# Altium project MB997.PrjPCB
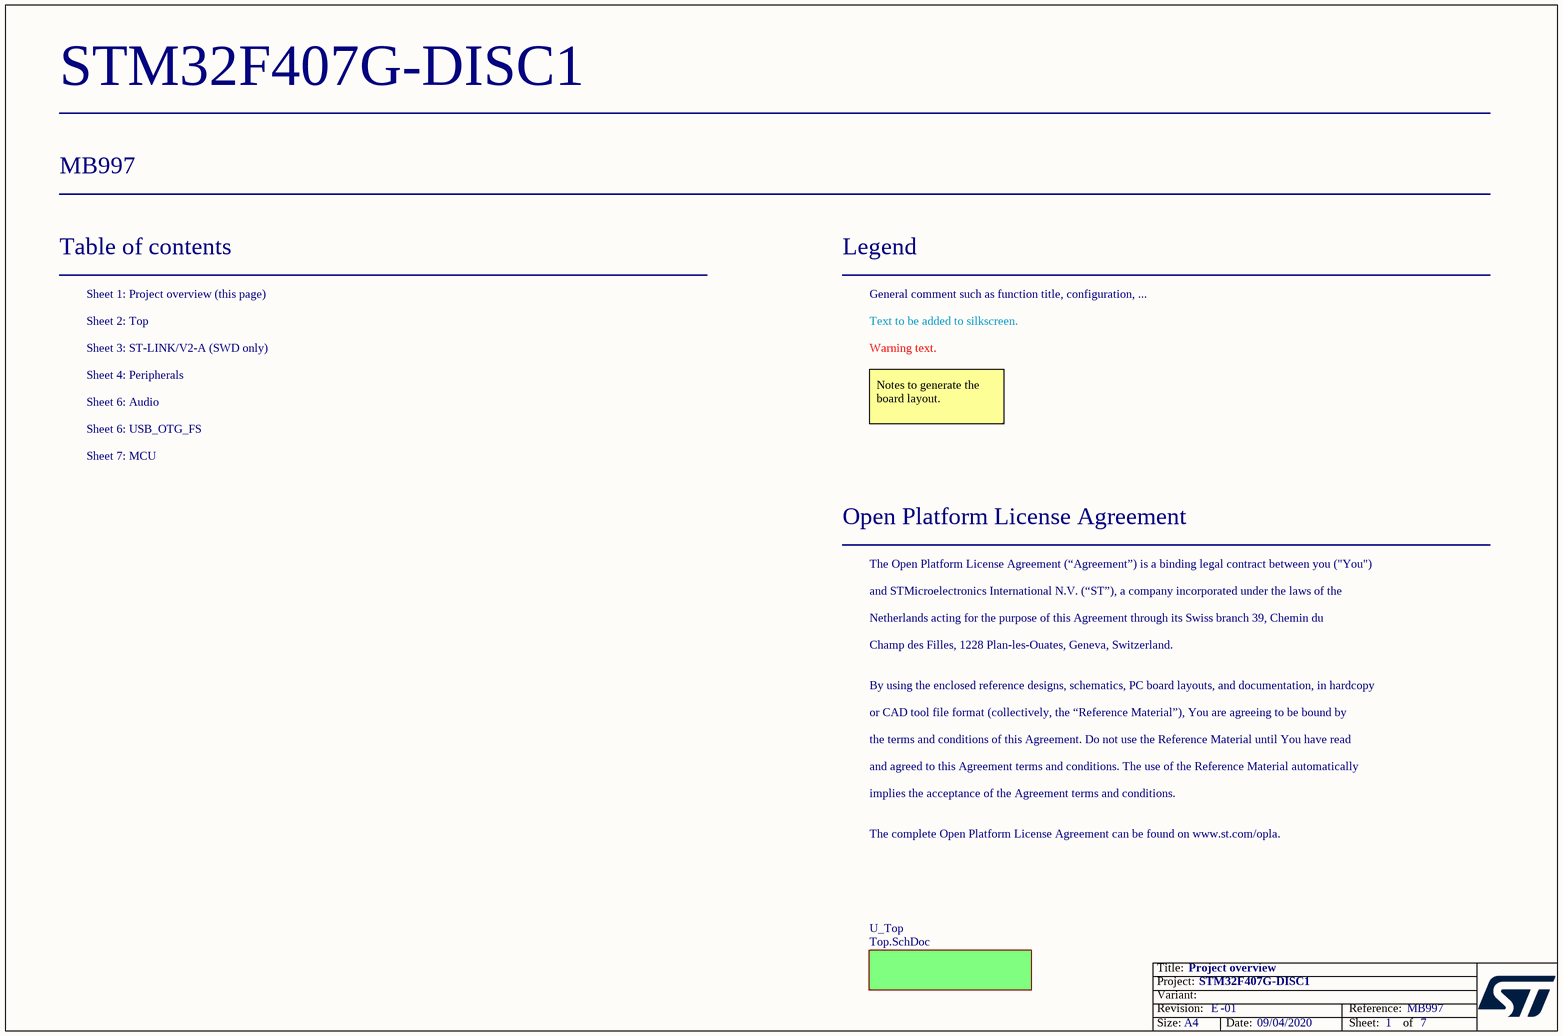
[diagram p0: Project_Overview.SchDoc]
Board_assembly_revision: 01; Board_Document_Date: 09/04/2020; Board_name: STM32F407G-DISC1; Board_PCB_REVISION: E; Board_reference: MB997
7 sheets, 191 parts. Net scope: flat (ports and power ports of the same name join across sheets).
Board file: MB997.PcbDoc
Sheets:
  Project_Overview.SchDoc
    U_Top = Top.SchDoc
      U_ST_LINK = ST_LINK_V2.SCHDOC
      U_Audio = Audio.SchDoc
      U_IO Peripherals = IO Peripherals.SchDoc
      U_STM32Fx = STM32Fx.SchDoc
      U_USB_OTG_FS = USB_OTG_FS.SchDoc

## Sheet Project_Overview.SchDoc: Project overview
size A4; Date: Not used; ApprovedBy: Not used; CheckedBy: Not used; Author: Not used; CompanyName: STMicroelectronics; DrawnBy: Not used; Engineer: Not used; Organization: Not used; Address1: Not used; Address2: Not used; Address3: Not used; Address4: Not used; DocumentNumber: 1; Revision: Not used; SheetNumber: 1; SheetTotal: 7; CurrentTime: Not used; CurrentDate: Not used; Time: Not used; DocumentFullPathAndName: Not used; DocumentName: Not used; ModifiedDate: Not used; ImagePath: Not used; ProjectName: Not used; Application_BuildNumber: Not used

### Sub-sheets
U_Top = Top.SchDoc: no entries

### Notes on the sheet
- Table of contents
- Sheet 1: Project overview (this page)
- Legend
- General comment such as function title, configuration, ...
- Sheet 2: Top
- Sheet 3: ST-LINK/V2-A (SWD only)
- Sheet 4: Peripherals
- Text to be added to silkscreen.
- Warning text.
- Sheet 6: Audio
- Sheet 6: USB_OTG_FS
- Notes to generate the board layout.
- Sheet 7: MCU
- Open Platform License Agreement
- The Open Platform License Agreement (“Agreement”) is a binding legal contract between you ("You")
- and STMicroelectronics International N.V. (“ST”), a company incorporated under the laws of the
- Netherlands acting for the purpose of this Agreement through its Swiss branch 39, Chemin du
- Champ des Filles, 1228 Plan-les-Ouates, Geneva, Switzerland.
- By using the enclosed reference designs, schematics, PC board layouts, and documentation, in hardcopy
- or CAD tool file format (collectively, the “Reference Material”), You are agreeing to be bound by
- the terms and conditions of this Agreement. Do not use the Reference Material until You have read
- and agreed to this Agreement terms and conditions. The use of the Reference Material automatically
- implies the acceptance of the Agreement terms and conditions.
- The complete Open Platform License Agreement can be found on www.st.com/opla.
- Title:
- Project:
- Size:
- Revision:
- Variant:
- A4
- -
- Date:
- Reference:
- Sheet:
- of

## Sheet Top.SchDoc: TOP
size A4; DocumentNumber: 2; Revision: D.1(PCB.SCH); SheetNumber: 2; SheetTotal: 7
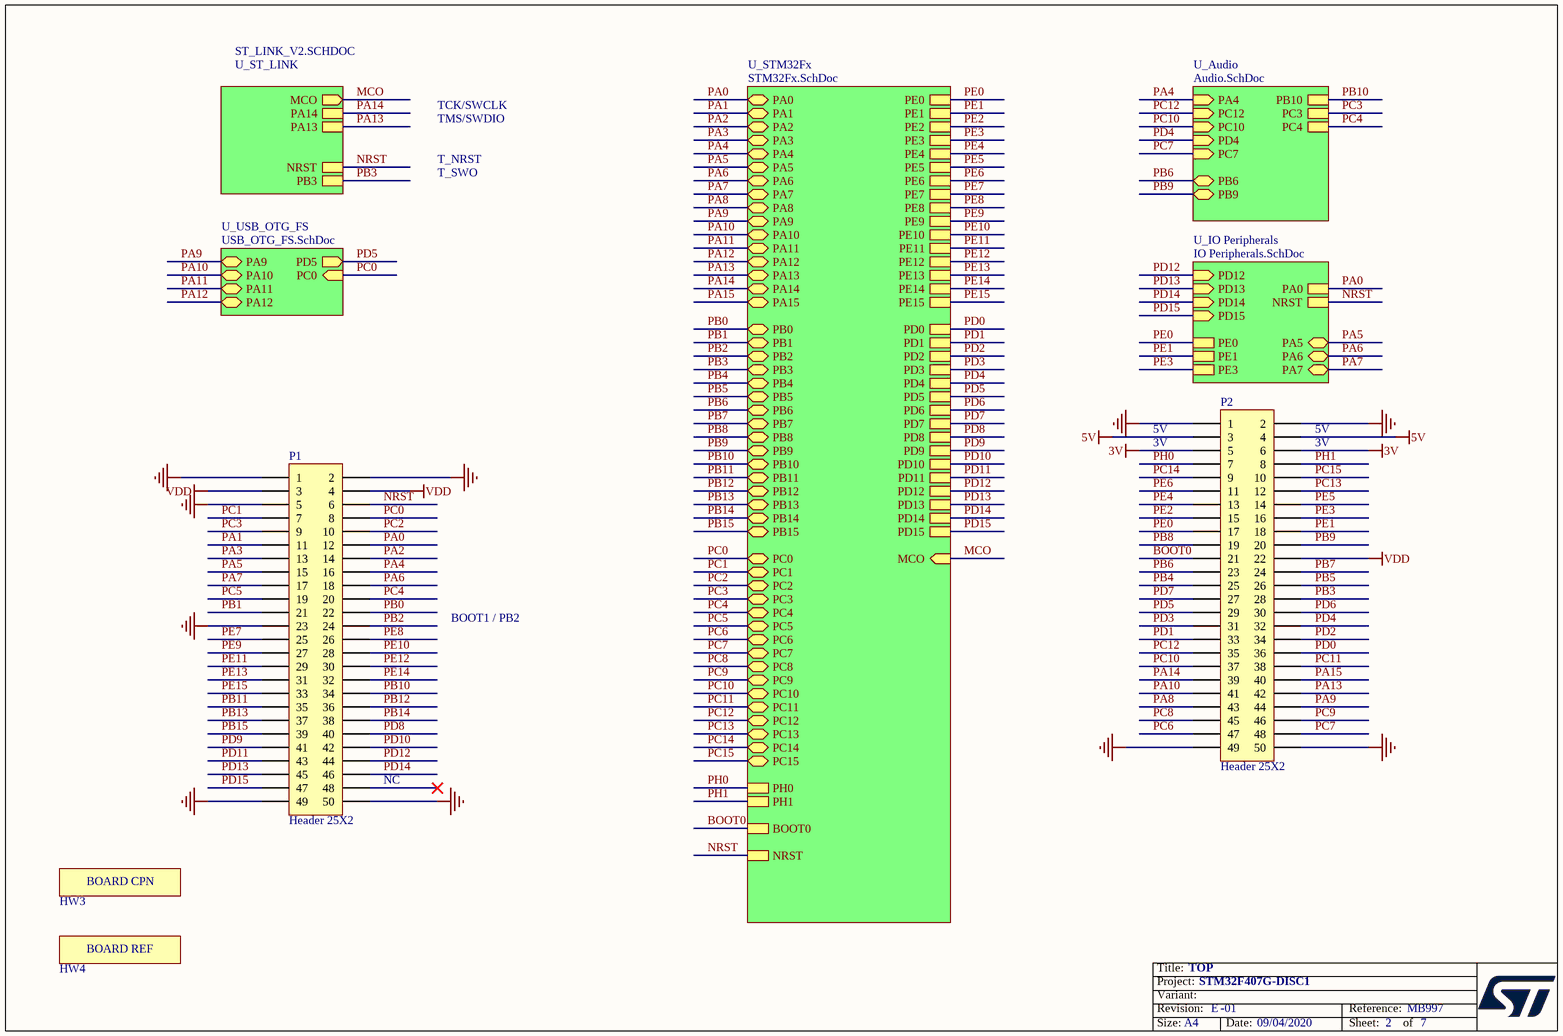
[diagram p1: Top.SchDoc]

### Parts
HW3  STICKER_BOARD_CPN  [STICKER_25X9_]  (value not drawn)  (no BOM)
HW4  STICKER_BOARD_REF  [STICKER_25X9_]  (value not drawn)  (no BOM)
P1  Header 25X2  [HEAD25X2$2F$2.54]
P2  Header 25X2  [HEAD25X2$2F$2.54]

### Sub-sheets
U_Audio = Audio.SchDoc: PA4 (in), PC12 (in), PC10 (in), PB6 (bidir), PB9 (bidir), PD4 (in), PC7 (in), PC3, PB10, PC4
U_IO Peripherals = IO Peripherals.SchDoc: PA0, NRST, PD12 (in), PE0, PD13 (in), PD14 (in), PD15 (in), PE1, PA5 (bidir), PA7 (bidir), PE3, PA6 (bidir)
U_ST_LINK = ST_LINK_V2.SCHDOC: PA13, PA14, NRST, PB3, MCO (out)
U_STM32Fx = STM32Fx.SchDoc: PA13 (bidir), PA14 (bidir), PA15 (bidir), PA12 (bidir), PA0 (bidir), PA1 (bidir), PA2 (bidir), PA3 (bidir), PA4 (bidir), PA5 (bidir), PA6 (bidir), PA7 (bidir), PA8 (bidir), PA9 (bidir), PA10 (bidir), PA11 (bidir), PB12 (bidir), PB0 (bidir), PB1 (bidir), PB2 (bidir), PB3 (bidir), PB4 (bidir), PB5 (bidir), PB6 (bidir), PB7 (bidir), PB8 (bidir), PB9 (bidir), PB10 (bidir), PB11 (bidir), PB13 (bidir), PB14 (bidir), PB15 (bidir), PC3 (bidir), PC15 (bidir), PC14 (bidir), PC13 (bidir), PC12 (bidir), PC11 (bidir), PC10 (bidir), PC9 (bidir), PC8 (bidir), PC7 (bidir), PC6 (bidir), PC5 (bidir), PC4 (bidir), PC2 (bidir), PC1 (bidir), PC0 (bidir), PD2, BOOT0, PH1, PH0, NRST, MCO (in), PE0, PE1, PE2, PE3, PE4, PE5, PE6, PE7, PE8, PE9, PE10, PE11, PE12, PE13, PE14, PE15, PD0, PD1, PD3, PD4, PD5, PD6, PD7, PD8, PD9, PD10, PD11, PD12, PD13, PD14, PD15
U_USB_OTG_FS = USB_OTG_FS.SchDoc: PD5 (out), PA11 (bidir), PA12 (bidir), PC0 (in), PA10 (bidir), PA9 (bidir)

### Nets
3V: P2.5 P2.6
5V: P2.3 P2.4
GND: P1.1 P1.2 P1.5 P1.23 P1.49 P1.50 P2.1 P2.2 P2.49 P2.50
VDD: P1.3 P1.4 P2.22
BOOT0: P2.21 ; sheet U_STM32Fx/BOOT0
MCO: sheet U_ST_LINK/MCO, sheet U_STM32Fx/MCO
NRST: P1.6 ; sheet U_ST_LINK/NRST, sheet U_IO Peripherals/NRST, sheet U_STM32Fx/NRST
PA0: P1.12 ; sheet U_IO Peripherals/PA0, sheet U_STM32Fx/PA0
PA1: P1.11 ; sheet U_STM32Fx/PA1
PA2: P1.14 ; sheet U_STM32Fx/PA2
PA3: P1.13 ; sheet U_STM32Fx/PA3
PA4: P1.16 ; sheet U_Audio/PA4, sheet U_STM32Fx/PA4
PA5: P1.15 ; sheet U_IO Peripherals/PA5, sheet U_STM32Fx/PA5
PA6: P1.18 ; sheet U_IO Peripherals/PA6, sheet U_STM32Fx/PA6
PA7: P1.17 ; sheet U_IO Peripherals/PA7, sheet U_STM32Fx/PA7
PA8: P2.43 ; sheet U_STM32Fx/PA8
PA9: P2.44 ; sheet U_STM32Fx/PA9, sheet U_USB_OTG_FS/PA9
PA10: P2.41 ; sheet U_STM32Fx/PA10, sheet U_USB_OTG_FS/PA10
PA11: sheet U_STM32Fx/PA11, sheet U_USB_OTG_FS/PA11
PA12: sheet U_STM32Fx/PA12, sheet U_USB_OTG_FS/PA12
PA13: P2.42 ; sheet U_ST_LINK/PA13, sheet U_STM32Fx/PA13
PA14: P2.39 ; sheet U_ST_LINK/PA14, sheet U_STM32Fx/PA14
PA15: P2.40 ; sheet U_STM32Fx/PA15
PB0: P1.22 ; sheet U_STM32Fx/PB0
PB1: P1.21 ; sheet U_STM32Fx/PB1
PB2: P1.24 ; sheet U_STM32Fx/PB2
PB3: P2.28 ; sheet U_ST_LINK/PB3, sheet U_STM32Fx/PB3
PB4: P2.25 ; sheet U_STM32Fx/PB4
PB5: P2.26 ; sheet U_STM32Fx/PB5
PB6: P2.23 ; sheet U_Audio/PB6, sheet U_STM32Fx/PB6
PB7: P2.24 ; sheet U_STM32Fx/PB7
PB8: P2.19 ; sheet U_STM32Fx/PB8
PB9: P2.20 ; sheet U_Audio/PB9, sheet U_STM32Fx/PB9
PB10: P1.34 ; sheet U_Audio/PB10, sheet U_STM32Fx/PB10
PB11: P1.35 ; sheet U_STM32Fx/PB11
PB12: P1.36 ; sheet U_STM32Fx/PB12
PB13: P1.37 ; sheet U_STM32Fx/PB13
PB14: P1.38 ; sheet U_STM32Fx/PB14
PB15: P1.39 ; sheet U_STM32Fx/PB15
PC0: P1.8 ; sheet U_STM32Fx/PC0, sheet U_USB_OTG_FS/PC0
PC1: P1.7 ; sheet U_STM32Fx/PC1
PC2: P1.10 ; sheet U_STM32Fx/PC2
PC3: P1.9 ; sheet U_Audio/PC3, sheet U_STM32Fx/PC3
PC4: P1.20 ; sheet U_Audio/PC4, sheet U_STM32Fx/PC4
PC5: P1.19 ; sheet U_STM32Fx/PC5
PC6: P2.47 ; sheet U_STM32Fx/PC6
PC7: P2.48 ; sheet U_Audio/PC7, sheet U_STM32Fx/PC7
PC8: P2.45 ; sheet U_STM32Fx/PC8
PC9: P2.46 ; sheet U_STM32Fx/PC9
PC10: P2.37 ; sheet U_Audio/PC10, sheet U_STM32Fx/PC10
PC11: P2.38 ; sheet U_STM32Fx/PC11
PC12: P2.35 ; sheet U_Audio/PC12, sheet U_STM32Fx/PC12
PC13: P2.12 ; sheet U_STM32Fx/PC13
PC14: P2.9 ; sheet U_STM32Fx/PC14
PC15: P2.10 ; sheet U_STM32Fx/PC15
PD0: P2.36 ; sheet U_STM32Fx/PD0
PD1: P2.33 ; sheet U_STM32Fx/PD1
PD2: P2.34 ; sheet U_STM32Fx/PD2
PD3: P2.31 ; sheet U_STM32Fx/PD3
PD4: P2.32 ; sheet U_Audio/PD4, sheet U_STM32Fx/PD4
PD5: P2.29 ; sheet U_STM32Fx/PD5, sheet U_USB_OTG_FS/PD5
PD6: P2.30 ; sheet U_STM32Fx/PD6
PD7: P2.27 ; sheet U_STM32Fx/PD7
PD8: P1.40 ; sheet U_STM32Fx/PD8
PD9: P1.41 ; sheet U_STM32Fx/PD9
PD10: P1.42 ; sheet U_STM32Fx/PD10
PD11: P1.43 ; sheet U_STM32Fx/PD11
PD12: P1.44 ; sheet U_IO Peripherals/PD12, sheet U_STM32Fx/PD12
PD13: P1.45 ; sheet U_IO Peripherals/PD13, sheet U_STM32Fx/PD13
PD14: P1.46 ; sheet U_IO Peripherals/PD14, sheet U_STM32Fx/PD14
PD15: P1.47 ; sheet U_IO Peripherals/PD15, sheet U_STM32Fx/PD15
PE0: P2.17 ; sheet U_IO Peripherals/PE0, sheet U_STM32Fx/PE0
PE1: P2.18 ; sheet U_IO Peripherals/PE1, sheet U_STM32Fx/PE1
PE2: P2.15 ; sheet U_STM32Fx/PE2
PE3: P2.16 ; sheet U_IO Peripherals/PE3, sheet U_STM32Fx/PE3
PE4: P2.13 ; sheet U_STM32Fx/PE4
PE5: P2.14 ; sheet U_STM32Fx/PE5
PE6: P2.11 ; sheet U_STM32Fx/PE6
PE7: P1.25 ; sheet U_STM32Fx/PE7
PE8: P1.26 ; sheet U_STM32Fx/PE8
PE9: P1.27 ; sheet U_STM32Fx/PE9
PE10: P1.28 ; sheet U_STM32Fx/PE10
PE11: P1.29 ; sheet U_STM32Fx/PE11
PE12: P1.30 ; sheet U_STM32Fx/PE12
PE13: P1.31 ; sheet U_STM32Fx/PE13
PE14: P1.32 ; sheet U_STM32Fx/PE14
PE15: P1.33 ; sheet U_STM32Fx/PE15
PH0: P2.7 ; sheet U_STM32Fx/PH0
PH1: P2.8 ; sheet U_STM32Fx/PH1

Not connected (* = marked no-connect by the designer): P1 48*

### Notes on the sheet
- TCK/SWCLK
- TMS/SWDIO
- T_SWO
- T_NRST
- 5V
- 3V
- (near P2) 5V
- (near P2) 3V
- BOOT1 / PB2
- (near P1) NC
- Title:
- Project:
- Size:
- Revision:
- Variant:
- A4
- -
- Date:
- Reference:
- Sheet:
- of
- (in symbol STICKER_BOARD_CPN) BOARD CPN
- (in symbol STICKER_BOARD_REF) BOARD REF

### Library data of the parts
P1 = Header 25X2: Header, 25-Pin, Dual row; Manuf_Part_1: 313250S141145; Manuf_1: LYCN; LatestRevisionDate: 17-Jul-2002; LatestRevisionNote: Re-released for DXP Platform.; Publisher: Altium Limited
P2 = Header 25X2: Header, 25-Pin, Dual row; Manuf_1: LYCN; Manuf_Part_1: 313250S141145; LatestRevisionDate: 17-Jul-2002; LatestRevisionNote: Re-released for DXP Platform.; Publisher: Altium Limited

## Sheet ST_LINK_V2.SCHDOC: ST-LINK/V2-A (SWD only)
size A4; DocumentNumber: 3; Revision: D.1(PCB.SCH); SheetNumber: 3; SheetTotal: 7
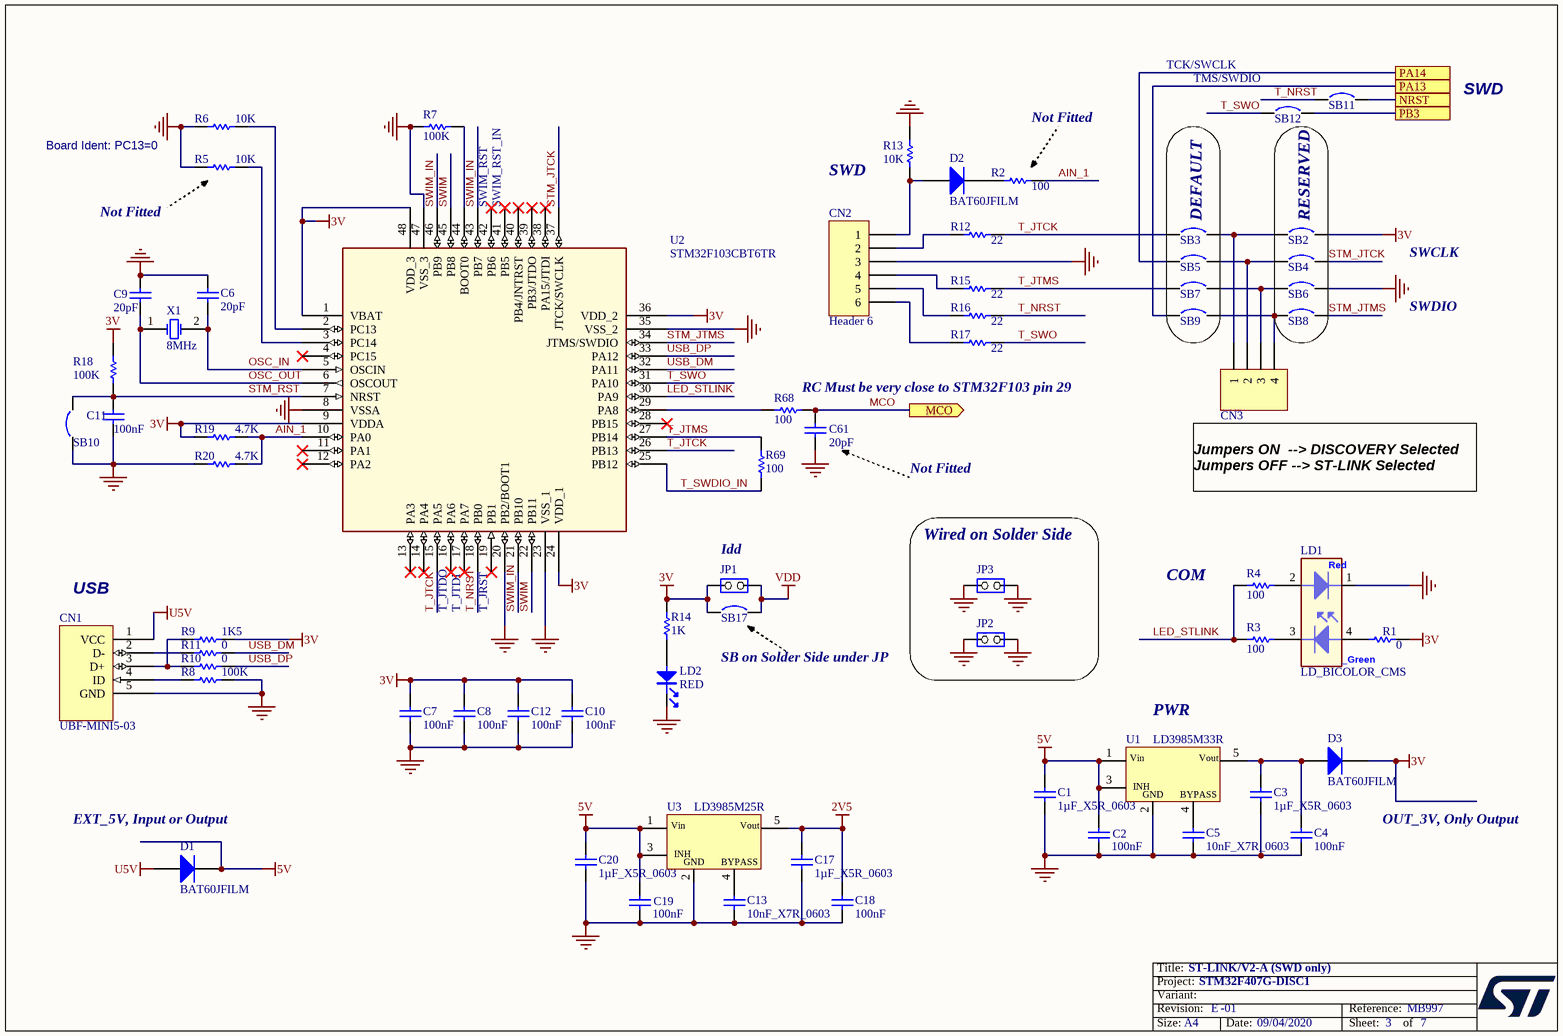
[diagram p2: ST_LINK_V2.SCHDOC]

### Parts
C1  1µF_X5R_0603  [0603C]
C2  100nF  [0402C]
C3  1µF_X5R_0603  [0603C]
C4  100nF  [0402C]
C5  10nF_X7R_0603  [0603C]
C6  20pF  [0402C]
C7  100nF  [0402C]
C8  100nF  [0402C]
C9  20pF  [0402C]
C10  100nF  [0402C]
C11  100nF  [0402C]
C12  100nF  [0402C]
C13  10nF_X7R_0603  [0603C]
C17  1µF_X5R_0603  [0603C]
C18  100nF  [0402C]
C19  100nF  [0402C]
C20  1µF_X5R_0603  [0603C]
C61  20pF  [0603C]
CN1  UBF-MINI5-03  [USB-MINI-B-SMD-A_]
CN2  Header 6  [HEADER6$2F$2.54]
CN3  Header 4  [HEADER4$2F$2.54]  (value not drawn)
D1  BAT60JFILM  [SOD323$2F$A]
D2  BAT60JFILM  [SOD323$2F$A]
D3  BAT60JFILM  [SOD323$2F$A]
JP1  (no value)  [SIP2$2F$2.54]
JP2  (no value)  [SIP2$2F$2.54]
JP3  (no value)  [SIP2$2F$2.54]
LD1  LD_BICOLOR_CMS  [AV02-0501EN]
LD2  RED  [LED0603]
R1  0  [0603R]
R2  100  [0402R]
R3  100  [0402R]
R4  100  [0402R]
R5  10K  [0402R]
R6  10K  [0402R]
R7  100K  [0402R]
R8  100K  [0402R]
R9  1K5  [0402R]
R10  0  [0603R]
R11  0  [0603R]
R12  22  [0402R]
R13  10K  [0402R]
R14  1K  [0402R]
R15  22  [0402R]
R16  22  [0402R]
R17  22  [0402R]
R18  100K  [0402R]
R19  4.7K  [0402R]
R20  4.7K  [0402R]
R68  100  [0603R]
R69  100  [0402R]
SB2  Circuit Breaker  [JUMPER]  (value not drawn)
SB3  Circuit Breaker  [JUMPER]  (value not drawn)
SB4  Circuit Breaker  [JUMPER]  (value not drawn)
SB5  Circuit Breaker  [JUMPER]  (value not drawn)
SB6  Circuit Breaker  [JUMPER]  (value not drawn)
SB7  Circuit Breaker  [JUMPER]  (value not drawn)
SB8  Circuit Breaker  [JUMPER]  (value not drawn)
SB9  Circuit Breaker  [JUMPER]  (value not drawn)
SB10  Circuit Breaker  [JUMPER]  (value not drawn)
SB11  Circuit Breaker  [JUMPER]  (value not drawn)
SB12  Circuit Breaker  [JUMPER]  (value not drawn)
SB17  Circuit Breaker  [JUMPER]  (value not drawn)
U1  LD3985M33R  [SOT-23-5L]
U2  STM32F103CBT6TR  [LQFP48$2F$0.5MM$5C$9X9B]
U3  LD3985M25R  [SOT-23-5L]
X1  8MHz  [HC-49A]

### Blocks framed on the sheet
DEFAULT: SB3 SB5 SB7 SB9
RESERVED: SB2 SB4 SB6 SB8
Wired on Solder Side: JP2 JP3

### Ports
MCO (out), NRST, PA13, PA14, PB3

### Nets
2V5: C17.1 C18.2 U3.5(Vout)
3V: C7.2 C8.2 C10.2 C12.1 D3.2(K) JP1.1(COMMON) R1.2 R9.2 R14.2 R18.2 R19.1 SB2.2 SB17.1 U2.1(VBAT) U2.9(VDDA) U2.24(VDD_1) U2.36(VDD_2) U2.48(VDD_3)
5V: C1.2 C2.2 C19.2 C20.2 D1.2(K) U1.1(Vin) U1.3(CE) U3.1(Vin) U3.3(CE)
GND: C1.1 C2.1 C3.2 C4.1 C5.1 C6.1 C7.1 C8.1 C9.1 C10.1 C11.1 C12.2 C13.1 C17.2 C18.1 C19.1 C20.1 C61.2 CN1.5(GND) CN2.3 JP2.1(COMMON) JP2.2(NO) JP3.1(COMMON) JP3.2(NO) LD1.1 LD2.2 R5.1 R6.1 R7.1 R8.2 R13.2 R20.1 SB6.2 SB10.1 U1.2(GND) U2.8(VSSA) U2.20(PB2/BOOT1) U2.23(VSS_1) U2.35(VSS_2) U2.47(VSS_3) U3.2(GND)
U5V: CN1.1(VCC) D1.1(A)
VDD: JP1.2(NO) SB17.2
AIN_1: R2.2 R19.2 R20.2 U2.10(PA0)
LED_STLINK: R3.1 R4.1 U2.30(PA9)
MCO: C61.1 R68.2 ; port MCO
NRST: SB11.2 ; port NRST
OSC_IN: C6.2 U2.5(OSCIN) X1.2(OSC2)
OSC_OUT: C9.2 U2.6(OSCOUT) X1.1(OSC1)
PA13: SB9.1 ; port PA13
PA14: SB5.1 ; port PA14
PB3: SB12.2 ; port PB3
STM_JTCK: SB4.2 U2.37(JTCK/SWCLK)
STM_JTMS: SB8.2 U2.34(JTMS/SWDIO)
STM_RST: C11.2 R18.1 SB10.2 U2.7(NRST)
SWIM: U2.22(PB11) U2.45(PB8)
SWIM_IN: U2.21(PB10) U2.43(PB7) U2.46(PB9)
T_JTCK: R12.2 SB3.1 U2.15(PA5) U2.26(PB13)
T_JTMS: R15.2 R69.2 SB7.1 U2.27(PB14)
T_NRST: R16.2 SB11.1 U2.18(PB0)
T_SWDIO_IN: R69.1 U2.25(PB12)
T_SWO: R17.2 SB12.1 U2.31(PA10)
USB_DM: R11.2 U2.32(PA11)
USB_DP: R10.2 U2.33(PA12)
NetC3_1: C3.1 C4.2 D3.1(A) U1.5(Vout)
NetC5_2: C5.2 U1.4(BYPASS)
NetC13_2: C13.2 U3.4(BYPASS)
NetCN1_2: CN1.2(D-) R11.1
NetCN1_3: CN1.3(D+) R9.1 R10.1
NetCN1_4: CN1.4(ID) R8.1
NetCN2_1: CN2.1 D2.1(A) R13.1
NetCN2_2: CN2.2 R12.1
NetCN2_4: CN2.4 R15.1
NetCN2_5: CN2.5 R16.1
NetCN2_6: CN2.6 R17.1
NetCN3_1: CN3.1 SB2.1 SB3.2
NetCN3_2: CN3.2 SB4.1 SB5.2
NetCN3_3: CN3.3 SB6.1 SB7.2
NetCN3_4: CN3.4 SB8.1 SB9.2
NetD2_2: D2.2(K) R2.1
NetLD1_2: LD1.2 R4.2
NetLD1_3: LD1.3 R3.2
NetLD1_4: LD1.4 R1.1
NetLD2_1: LD2.1 R14.1
NetR5_2: R5.2 U2.3(PC14)
NetR6_2: R6.2 U2.2(PC13)
NetR7_2: R7.2 U2.44(BOOT0)
NetR68_1: R68.1 U2.29(PA8)

Not connected (* = marked no-connect by the designer): U2 4(PC15)* 11(PA1)* 12(PA2)* 13(PA3)* 14(PA4)* 16(PA6)* 17(PA7)* 19(PB1)* 28(PB15)* 38(PA15/JTDI)* 39(PB3/JTDO)* 40(PB4/JNTRST)* 41(PB5)* 42(PB6)*

### Notes on the sheet
- TCK/SWCLK
- (near SB12) TMS/SWDIO
- SWD
- Board Ident: PC13=0
- Not Fitted
- SWIM_RST
- SWIM_RST_IN
- SWCLK
- SWDIO
- (near R68) RC Must be very close to STM32F103 pin 29
- Jumpers ON  --> DISCOVERY Selected
  Jumpers OFF --> ST-LINK Selected
- (near JP1) Idd
- COM
- (near CN1) USB
- (near U2) T_JTDO
- (near U2) T_JTDI
- (near U2) T_JRST
- SB on Solder Side under JP
- (near U1) PWR
- (near D1) EXT_5V, Input or Output
- OUT_3V, Only Output
- Title:
- Project:
- Size:
- Revision:
- Variant:
- A4
- -
- Date:
- Reference:
- Sheet:
- of
- (in symbol LD3985M25R) INH
- (in symbol LD3985M33R) INH
- (in symbol LD_BICOLOR_CMS) Red; _Green

### Library data of the parts
C1 C3 C17 C20 = CAP SMD 0603  X5R 1µF 25V 10%: 0603  X5R 1µF; Manuf_1: YAGEO; Manuf_Part_1: CC0603KRX5R7BB105; Value: 1uF; Rated voltage: 25V; Tolerance: 10%; Order code Farnell: 1288202RL; Power: *; Technology: X5R; Temperature  Factor: *; Temperature Max: +125°C; Temperature Min: -55°C; STS Code: *
C2 C4 C7 C8 C10-C12 C18 C19 = Cap: Capacitor; Manuf_Part_1: CC0402KRX7R7BB104; Manuf_1: YAGEO; Published: 8-Jun-2000; Revision: July-2002: Re-released for DXP Platform.; Publisher: Altium Limited; Value: 100nF
C5 C13 = CAP SMD 0603  X7R 10000PF 50V 10%: 0603  X7R 10NF; Manuf_1: YAGEO; Manuf_Part_1: CC0603KRX7R9BB103; Order code RS: 2040779; Rated voltage: 50V; Tolerance: 10%; Order code Farnell: 7569548RL; Value: 10nF; Power: *; Technology: X7R; Temperature Factor: *; Temperature Min: -55°C; Temperature Max: +125°C; STS Code: *
C6 C9 = Cap: Capacitor; Manuf_Part_1: CC0402JRNPO9BN200; Manuf_1: YAGEO; Published: 8-Jun-2000; Publisher: Altium Limited; Value: 20pF; Revision: July-2002: Re-released for DXP Platform.
C61 = Cap: Capacitor; Fitted: NO; Published: 8-Jun-2000; Publisher: Altium Limited; Value: 20pF; Revision: July-2002: Re-released for DXP Platform.
CN1 = USB-MINI-typeB connector_: Manuf_1: MTCONN; Manuf_Part_1: UBF-MINI5-03
CN2 = Header 6: Header, 6-Pin; Manuf_Part_1: 313106S141116; Manuf_1: LYCN; LatestRevisionDate: 17-Jul-2002; LatestRevisionNote: Re-released for DXP Platform.; Publisher: Altium Limited
CN3 = Header 4: Header, 4-Pin; Manuf_1: LYCN; Manuf_Part_1: 313104S141116; Revision: 17-Jul-2002: Re-released for DXP Platform.; Publisher: Altium Limited
D1-D3 = BAT60JFILM: Manuf_1: STM; Code - JEDEC: DO-214-AB; Provided: ST; Published: 8-Jun-2000; Revision: July-2002: Re-released for DXP Platform.; Publisher: Altium Limited; Order: BAT60JFILM; Manuf_Part_1: BAT60JFILM
JP1 = JP2: Manuf_Part_1: 313102S141116; Manuf_1: LYCN
JP2 JP3 = JP2: Manuf_1: LYCN; Manuf_Part_1: 313102S141145
LD1 = LD_BICOLOR_CMS: Bicolor Led; Manuf_Part_1: HSMF-A201-A00J1; Manuf_1: Avago Technologies; Ref St: xxxxxx; cap_dec: ----; Distrib: RADIOSPARES; Footprint: HSMF-A201; support: ----
LD2 = PHOTO: Manuf_Part_1: 19-213-R6C-AP1Q2B-3T; Manuf_1: EVERLIGHT
R1 R10 R11 = res1: Resistor; Manuf_Part_1: RC0603JR-070RL; Manuf_1: YAGEO; Published: 8-Jun-2000; Revision: July-2002: Re-released for DXP Platform.; Publisher: Altium Limited; Value: 0
R2 = res1: Resistor; Fitted: NO; Published: 8-Jun-2000; Revision: July-2002: Re-released for DXP Platform.; Publisher: Altium Limited; Value: 100
R3 R4 R69 = res1: Resistor; Manuf_Part_1: RC0402FR-07100RL; Manuf_1: YAGEO; Published: 8-Jun-2000; Revision: July-2002: Re-released for DXP Platform.; Publisher: Altium Limited; Value: 100
R5 = res1: Resistor; Manuf_Part_1: RC0402FR-0710KL; Manuf_1: YAGEO; Fitted: NO; Published: 8-Jun-2000; Revision: July-2002: Re-released for DXP Platform.; Publisher: Altium Limited; Value: 10K
R6 R13 = res1: Resistor; Manuf_Part_1: RC0402FR-0710KL; Manuf_1: YAGEO; Published: 8-Jun-2000; Revision: July-2002: Re-released for DXP Platform.; Publisher: Altium Limited; Value: 10K
R7 R8 R18 = res1: Resistor; Manuf_Part_1: RC0402FR-07100KL; Manuf_1: YAGEO; Published: 8-Jun-2000; Revision: July-2002: Re-released for DXP Platform.; Publisher: Altium Limited; Value: 100K
R9 = res1: Resistor; Manuf_Part_1: RC0402FR-071K5L; Manuf_1: YAGEO; Published: 8-Jun-2000; Revision: July-2002: Re-released for DXP Platform.; Publisher: Altium Limited; Value: 1K5
R12 R15-R17 = res1: Resistor; Manuf_Part_1: RC0402FR-0722RL; Manuf_1: YAGEO; Published: 8-Jun-2000; Revision: July-2002: Re-released for DXP Platform.; Publisher: Altium Limited; Value: 22
R14 = res1: Resistor; Manuf_Part_1: RC0402FR-071KL; Manuf_1: YAGEO; Published: 8-Jun-2000; Revision: July-2002: Re-released for DXP Platform.; Publisher: Altium Limited; Value: 1K
R19 R20 = res1: Resistor; Manuf_Part_1: RC0402FR-074K7L; Manuf_1: YAGEO; Published: 8-Jun-2000; Revision: July-2002: Re-released for DXP Platform.; Publisher: Altium Limited; Value: 4.7K
R68 = res1: Resistor; Manuf_Part_1: RC0603FR-07100RL; Manuf_1: YAGEO; Published: 8-Jun-2000; Revision: July-2002: Re-released for DXP Platform.; Publisher: Altium Limited; Value: 100
SB2 SB4 SB6 SB8 SB10 SB17 = Circuit Breaker: Solder: NO; Published: 24-Mar-1999; Revision: July-2002: Re-released for DXP Platform.; Publisher: Altium Limited
SB3 SB5 SB7 SB9 SB11 SB12 = Circuit Breaker: Solder: YES; Published: 24-Mar-1999; Revision: July-2002: Re-released for DXP Platform.; Publisher: Altium Limited
U1 = LD3985M33R: Ultra low drop-low noise BiCMOS voltage, regulators low ESR capacitors compatible; Manuf_1: STM; Provided: ST; Manuf_Part_1: LD3985M33R
U2 = STM32F103CBT6: Medium-density performance line ARM-based 32-bit MCU with 128KB Flash; Manuf_1: STM; Ref St: xxxxxxxx; Provided: ST; ECCN_US/EU: 3A991A2/NEC; Footprint: QFP48 7X7; Manuf_Part_1: STM32F103CBT6TR; Order: STM32F103CBT6; Distrib: ST
U3 = LD3985M25R: Ultra low drop-low noise BiCMOS voltage, regulators low ESR capacitors compatible; Manuf_1: STM; Provided: ST; Manuf_Part_1: LD3985M25R
X1 = XTAL: Crystal Oscillator; Manuf_Part_1: HC-49S-C20QSA-8.000MHZ; Manuf_1: jfvny; Published: 8-Jun-2000; LatestRevisionDate: 17-Jul-2002; LatestRevisionNote: Re-released for DXP Platform.; PackageReference: R38; Publisher: Altium Limited

## Sheet Audio.SchDoc: Audio
size A4; DocumentNumber: 5; Revision: D.1(PCB.SCH); SheetNumber: 5; SheetTotal: 7
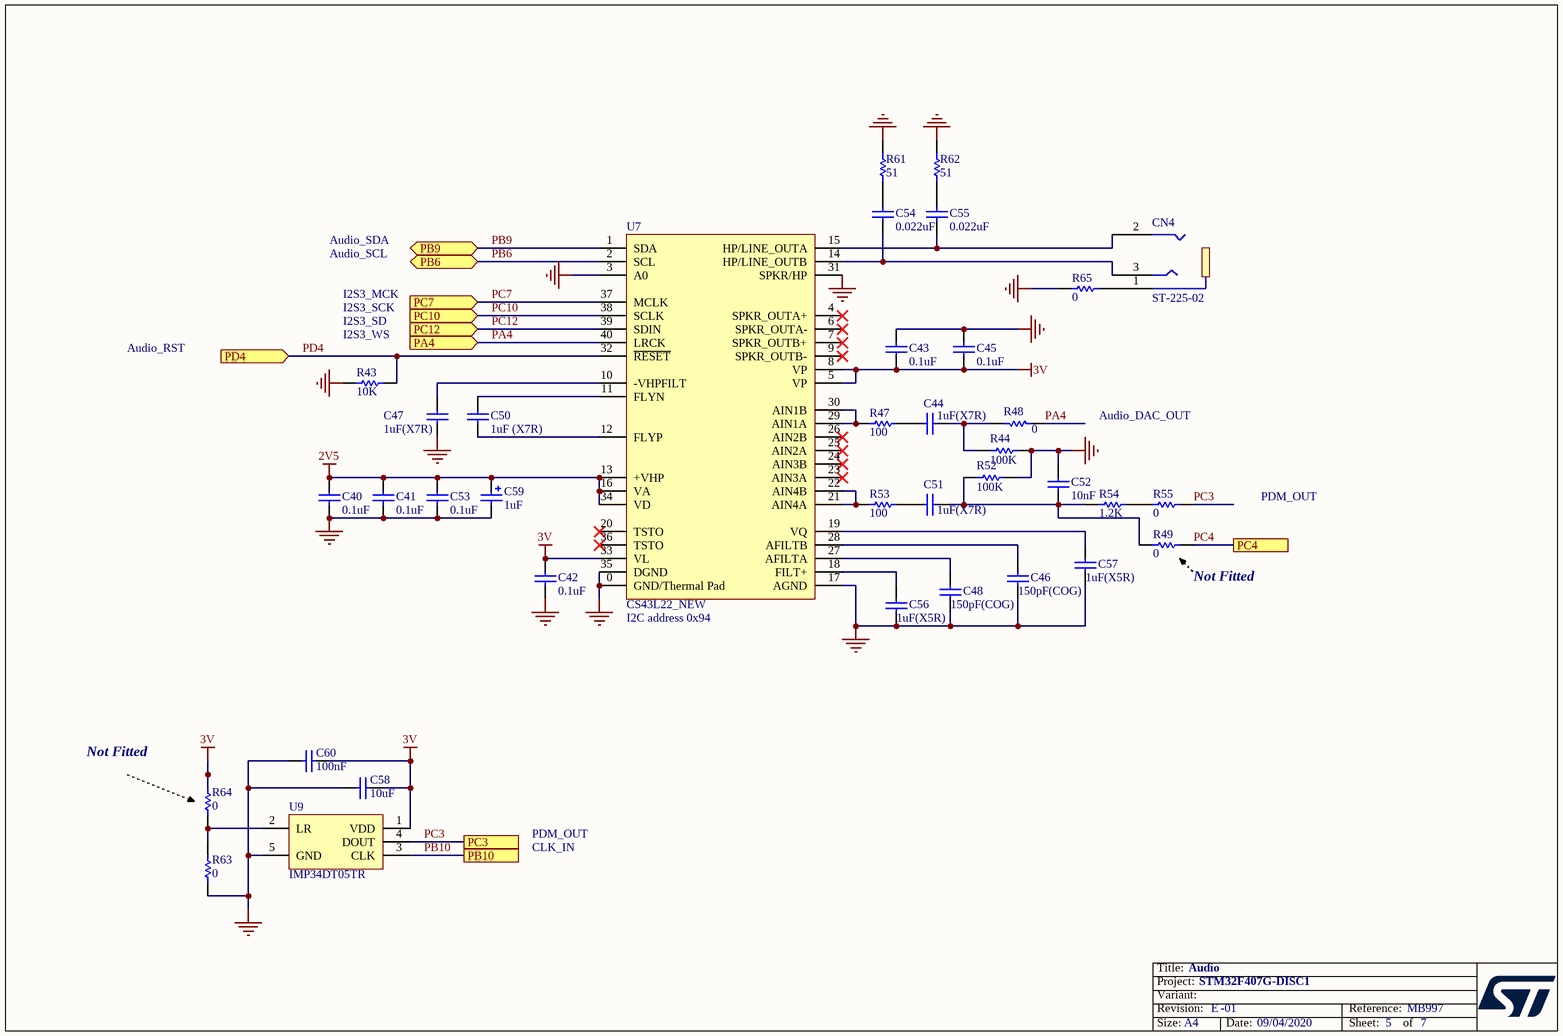
[diagram p3: Audio.SchDoc]

### Parts
C40  0.1uF  [0402C]
C41  0.1uF  [0402C]
C42  0.1uF  [0402C]
C43  0.1uF  [0402C]
C44  1uF(X7R)  [0603C]
C45  0.1uF  [0402C]
C46  150pF(COG)  [0603C]
C47  1uF(X7R)  [0603C]
C48  150pF(COG)  [0603C]
C50  1uF (X7R)  [0603C]
C51  1uF(X7R)  [0603C]
C52  10nF  [0603C]
C53  0.1uF  [0402C]
C54  0.022uF  [0603C]
C55  0.022uF  [0603C]
C56  1uF(X5R)  [0603C]
C57  1uF(X5R)  [0603C]
C58  10uF  [0603C]
C59  1uF  [CASE-A]
C60  100nF  [0402C]
CN4  ST-225-02  [PCBCOMPONENT_1$2F$2_new_]
R43  10K  [0402R]
R44  100K  [0402R]
R47  100  [0402R]
R48  0  [0603R]
R49  0  [0603R]
R52  100K  [0402R]
R53  100  [0402R]
R54  1.2K  [0603R]
R55  0  [0603R]
R61  51  [0603R]
R62  51  [0603R]
R63  0  [0402R]
R64  0  [0402R]
R65  0  [0603R]
U7  CS43L22_NEW  [QFN40(6_6)]
U9  IMP34DT05TR  [MIC_HCLGA_3X4X1_4LD_t]

### Ports
PA4 (in), PB6 (bidir), PB9 (bidir), PB10, PC3, PC4, PC7 (in), PC10 (in), PC12 (in), PD4 (in)

### Nets
2V5: C40.2 C41.2 C53.2 C59.1 U7.13(+VHP) U7.16(VA) U7.34(VD)
3V: C42.2 C43.2 C45.2 C58.2 C60.2 R64.2 U7.5(VP) U7.8(VP) U7.33(VL) U9.1(VDD)
GND: C40.1 C41.1 C42.1 C43.1 C45.1 C46.1 C47.2 C48.1 C52.2 C53.1 C56.1 C57.1 C58.1 C59.2 C60.1 R43.2 R44.2 R52.2 R61.1 R62.1 R63.1 R65.2 U7.0(GND/Thermal_Pad) U7.3(A0) U7.17(AGND) U7.31(SPKR/HP) U7.35(DGND) U9.5(GND)
PA4: R48.2 U7.40(LRCK) ; port PA4
PB6: U7.2(SCL) ; port PB6
PB9: U7.1(SDA) ; port PB9
PB10: U9.3(CLK) ; port PB10
PC3: R55.1 U9.4(DOUT) ; port PC3
PC4: R49.1 ; port PC4
PC7: U7.37(MCLK) ; port PC7
PC10: U7.38(SCLK) ; port PC10
PC12: U7.39(SDIN) ; port PC12
PD4: R43.1 U7.32(~{RESET}) ; port PD4
NetC44_1: C44.1 R47.1
NetC44_2: C44.2 R44.1 R48.1
NetC46_2: C46.2 U7.28(AFILTB)
NetC47_1: C47.1 U7.10(-VHPFILT)
NetC48_2: C48.2 U7.27(AFILTA)
NetC50_1: C50.1 U7.12(FLYP)
NetC50_2: C50.2 U7.11(FLYN)
NetC51_1: C51.1 R53.1
NetC51_2: C51.2 C52.1 R49.2 R52.1 R54.1
NetC54_1: C54.1 R61.2
NetC54_2: C54.2 CN4.3 U7.14(HP/LINE_OUTB)
NetC55_1: C55.1 R62.2
NetC55_2: C55.2 CN4.2 U7.15(HP/LINE_OUTA)
NetC56_2: C56.2 U7.18(FILT+)
NetC57_2: C57.2 U7.19(VQ)
NetCN4_1: CN4.1 R65.1
NetR47_2: R47.2 U7.29(AIN1A) U7.30(AIN1B)
NetR53_2: R53.2 U7.21(AIN4A) U7.22(AIN4B)
NetR54_2: R54.2 R55.2
NetR63_2: R63.2 R64.1 U9.2(LR)

Not connected (* = marked no-connect by the designer): U7 4(SPKR_OUTA+)* 6(SPKR_OUTA-)* 7(SPKR_OUTB+)* 9(SPKR_OUTB-)* 20(TSTO)* 23(AIN3A)* 24(AIN3B)* 25(AIN2A)* 26(AIN2B)* 36(TSTO)*

### Notes on the sheet
- Audio_SDA
- Audio_SCL
- I2S3_MCK
- I2S3_SCK
- Audio_RST
- (near R43) I2S3_WS
- I2S3_SD
- Audio_DAC_OUT
- PDM_OUT
- (near R49) Not Fitted
- (near U7) I2C address 0x94
- Not Fitted
- CLK_IN
- Title:
- Project:
- Size:
- Revision:
- Variant:
- A4
- -
- Date:
- Reference:
- Sheet:
- of

### Library data of the parts
C40-C43 C53 = CAP: Capacitor; Manuf_1: YAGEO; Manuf_Part_1: CC0402KRX7R7BB104; Value: 100nF; Published: 8-Jun-2000; Revision: July-2002: Re-released for DXP Platform.; Publisher: Altium Limited
C44 C47 C50 C51 C56 C57 = CAP: Capacitor; Manuf_Part_1: CC0603KRX5R7BB105; Manuf_1: YAGEO; Published: 8-Jun-2000; Revision: July-2002: Re-released for DXP Platform.; Publisher: Altium Limited; Value: 1uF
C45 = CAP: Capacitor; Manuf_Part_1: CC0402KRX7R7BB104; Manuf_1: YAGEO; Value: 100nF; Published: 8-Jun-2000; Revision: July-2002: Re-released for DXP Platform.; Publisher: Altium Limited
C46 C48 = CAP: Capacitor; Manuf_Part_1: CC0603JRNPO9BN151; Manuf_1: YAGEO; Published: 8-Jun-2000; Revision: July-2002: Re-released for DXP Platform.; Publisher: Altium Limited; Value: 150pF
C52 = CAP: Capacitor; Manuf_Part_1: CC0603KRX7R9BB103; Manuf_1: YAGEO; Published: 8-Jun-2000; Revision: July-2002: Re-released for DXP Platform.; Publisher: Altium Limited; Value: 10nF
C54 C55 = CAP: Capacitor; Manuf_Part_1: CC0603KRX7R9BB223; Manuf_1: YAGEO; Published: 8-Jun-2000; Revision: July-2002: Re-released for DXP Platform.; Publisher: Altium Limited; Value: 0.022uF
C58 = CAP: Capacitor; Manuf_Part_1: CC0603KRX5R5BB106; Manuf_1: YAGEO; Published: 8-Jun-2000; Revision: July-2002: Re-released for DXP Platform.; Publisher: Altium Limited; Value: 10uF
C59 = Cap Pol1: Polarized Capacitor (Radial); Manuf_Part_1: TAJA105K016R; Manuf_1: AVX; Published: 8-Jun-2000; Revision: July-2002: Re-released for DXP Platform.; Publisher: Altium Limited; Value: 1uF
C60 = CAP: Capacitor; Manuf_Part_1: CC0402KRX7R7BB104; Manuf_1: YAGEO; Published: 8-Jun-2000; Revision: July-2002: Re-released for DXP Platform.; Publisher: Altium Limited; Value: 100nF
CN4 = ST-225-02_: Connector Jack 35mm; Manuf_1: XIEJIA Electronics; Order: ST-225-02; Manuf_Part_1: ST-225-02
R43 = res1: as R6 on sheet ST_LINK_V2; Published: 8-Jun-2000; Revision: July-2002: Re-released for DXP Platform.; Publisher: Altium Limited; Value: 10K
R44 R52 = res1: as R7 on sheet ST_LINK_V2; Published: 8-Jun-2000; Revision: July-2002: Re-released for DXP Platform.; Publisher: Altium Limited; Value: 100K
R47 R53 = res1: as R3 on sheet ST_LINK_V2; Published: 8-Jun-2000; Revision: July-2002: Re-released for DXP Platform.; Publisher: Altium Limited; Value: 100
R48 R55 R65 = res1: as R1 on sheet ST_LINK_V2; Published: 8-Jun-2000; Revision: July-2002: Re-released for DXP Platform.; Publisher: Altium Limited; Value: 0
R49 = res1: Resistor; Manuf_Part_1: RC0603JR-070RL; Manuf_1: YAGEO; Fitted: NO; Published: 8-Jun-2000; Revision: July-2002: Re-released for DXP Platform.; Publisher: Altium Limited; Value: 0
R54 = res1: Resistor; Manuf_Part_1: RC0603FR-071K2L; Manuf_1: YAGEO; Published: 8-Jun-2000; Revision: July-2002: Re-released for DXP Platform.; Publisher: Altium Limited; Value: 1.2K
R61 R62 = res1: Resistor; Manuf_Part_1: RC0603FR-0751RL; Manuf_1: YAGEO; Published: 8-Jun-2000; Revision: July-2002: Re-released for DXP Platform.; Publisher: Altium Limited; Value: 51
R63 = res1: Resistor; Manuf_part_1: RC0402JR-070RL; Manuf_1: YAGEO; Published: 8-Jun-2000; Revision: July-2002: Re-released for DXP Platform.; Publisher: Altium Limited; Value: 0
R64 = res1: Resistor; Fitted: NO; Published: 8-Jun-2000; Revision: July-2002: Re-released for DXP Platform.; Publisher: Altium Limited; Value: 0
U7 = CS43L22_NEW: Low Power, Stereo DAC w/Headphone & Speaker Amps; Manuf_1: Cirrus; Manuf_Part_1: CS43L22-CNZ; Order: *; Fooprint: *
U9 = IMP34DT05TR: MEMS audio sensor omnidirectional digital microphone for industrial applications; Manuf_1: STM; Provided: ST; Ref St: 9177995; Manuf_Part_1: IMP34DT05TR; Order: *

## Sheet IO Peripherals.SchDoc: Peripherals
size A4; DocumentNumber: 4; Revision: D.1(PCB.SCH); SheetNumber: 4; SheetTotal: 7
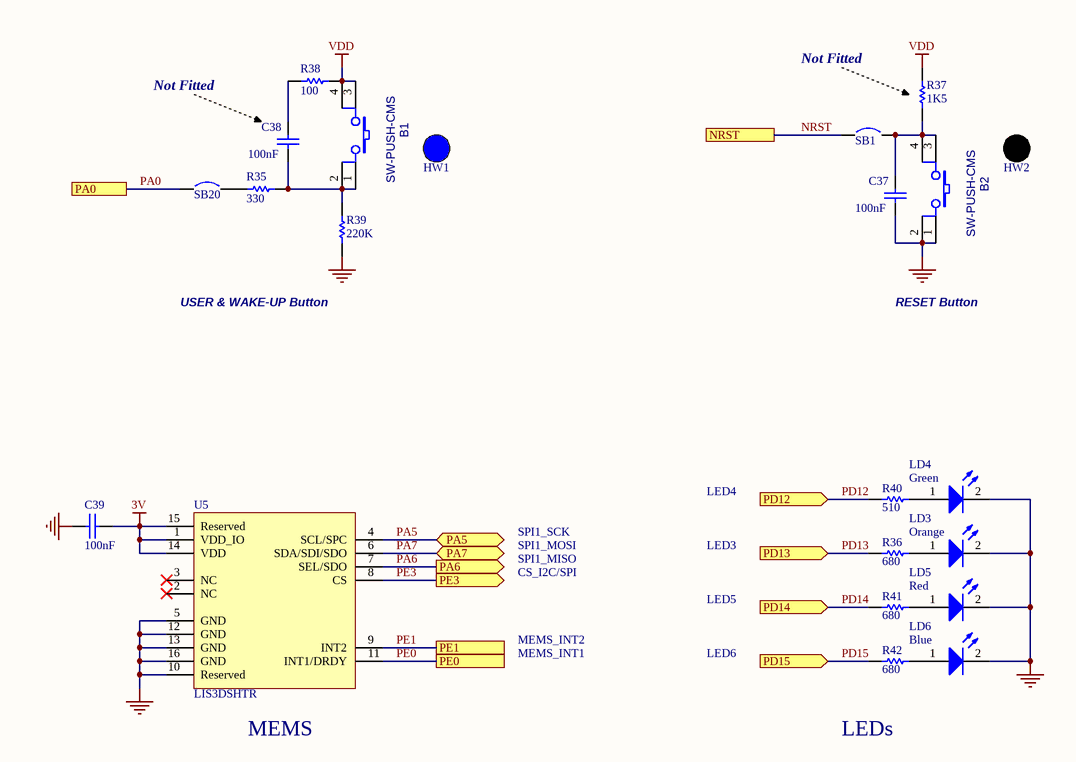
[diagram p4: IO Peripherals.SchDoc]

### Parts
B1  SW-PUSH-CMS  [SW4SMD]
B2  SW-PUSH-CMS  [SW4SMD]
C37  100nF  [0402C]
C38  100nF  [0402C]
C39  100nF  [0402C]
HW1  BUTTON_HAT_BLUE  (value not drawn)  (mechanical)
HW2  BUTTON_HAT_BLACK  (value not drawn)  (mechanical)
LD3  Orange  [LED0603]
LD4  Green  [LED0603]
LD5  Red  [LED0603]
LD6  Blue  [LED0603]
R35  330  [0603R]
R36  680  [0603R]
R37  1K5  [0402R]
R38  100  [0402R]
R39  220K  [0603R]
R40  510  [0603R]
R41  680  [0603R]
R42  680  [0603R]
SB1  Circuit Breaker  [JUMPER]  (value not drawn)
SB20  Circuit Breaker  [JUMPER]  (value not drawn)
U5  LIS3DSHTR  [LGA16_]

### Ports
NRST, PA0, PA5 (bidir), PA6 (out), PA7 (bidir), PD12 (in), PD13 (in), PD14 (in), PD15 (in), PE0, PE1, PE3 (out)

### Nets
3V: C39.2 U5.1(VDD_IO) U5.14(VDD) U5.15(Reserved)
GND: B2.1 B2.2 C37.1 C39.1 LD3.2(K) LD4.2(K) LD5.2(K) LD6.2(K) R39.1 U5.5(GND) U5.10(Reserved) U5.12(GND) U5.13(GND) U5.16(GND)
VDD: B1.3 B1.4 R37.2 R38.2
NRST: SB1.1 ; port NRST
PA0: SB20.1 ; port PA0
PA5: U5.4(SCL/SPC) ; port PA5
PA6: U5.7(SEL/SDO) ; port PA6
PA7: U5.6(SDA/SDI/SDO) ; port PA7
PD12: R40.2 ; port PD12
PD13: R36.2 ; port PD13
PD14: R41.2 ; port PD14
PD15: R42.2 ; port PD15
PE0: U5.11(INT1/DRDY) ; port PE0
PE1: U5.9(INT2) ; port PE1
PE3: U5.8(CS) ; port PE3
NetB1_1: B1.1 B1.2 C38.1 R35.2 R39.2
NetB2_3: B2.3 B2.4 C37.2 R37.1 SB1.2
NetC38_2: C38.2 R38.1
NetLD3_1: LD3.1(A) R36.1
NetLD4_1: LD4.1(A) R40.1
NetLD5_1: LD5.1(A) R41.1
NetLD6_1: LD6.1(A) R42.1
NetR35_1: R35.1 SB20.2

Not connected (* = marked no-connect by the designer): U5 2(NC)* 3(NC)*

### Notes on the sheet
- Not Fitted
- USER & WAKE-UP Button
- RESET Button
- LED4
- SPI1_MOSI
- SPI1_SCK
- SPI1_MISO
- CS_I2C/SPI
- LED3
- MEMS_INT2
- LED5
- MEMS_INT1
- LED6
- (near U5) MEMS
- LEDs
- Title:
- Project:
- Size:
- Revision:
- Variant:
- A4
- -
- Date:
- Reference:
- Sheet:
- of

### Library data of the parts
B1 = SW-PUSH-CMS_NEW: Non-Open Push-Button 0.1A 24V; Manuf_1: CHAU-HUA; Manuf_Part_1: CTSM-644B-V-T/R; cap_dec: ---
B2 = SW-PUSH-CMS_NEW: Non-Open Push-Button 0.1A 24V; Manuf_1: CHAU-HUA; Manuf_Part_1: CTSM-644N-V-T/R; cap_dec: ---
C37 C39 = CAP: as C60 on sheet Audio; Value: 100nF
  C37: Published: 8-Jun-2000; Revision: July-2002: Re-released for DXP Platform.; Publisher: Altium Limited
C38 = CAP: Capacitor; Fitted: NO; Published: 8-Jun-2000; Revision: July-2002: Re-released for DXP Platform.; Publisher: Altium Limited; Value: 100nF
HW1 = BUTTON_HAT_BLUE: switch hat,blue; Manuf_Part_1: KTSC-62B; Manuf_1: CHAU-HUA
HW2 = BUTTON_HAT_BLACK: switch hat,black; Manuf_1: CHAU-HUA; Manuf_Part_1: KTSC-62K
LD3 = LED2: Typical RED, GREEN, YELLOW, AMBER GaAs LED; Manuf_Part_1: 19-217/S2C-AM2N2VY/3T; Manuf_1: EVERLIGHT; Published: 8-Jun-2000; Revision: July-2002: Re-released for DXP Platform.; Publisher: Altium Limited
LD4 = LED2: Typical RED, GREEN, YELLOW, AMBER GaAs LED; Manuf_1: EVERLIGHT; Manuf_Part_1: 19-213SYGC/S530-E2/TR8; Published: 8-Jun-2000; Revision: July-2002: Re-released for DXP Platform.; Publisher: Altium Limited
LD5 = LED2: Typical RED, GREEN, YELLOW, AMBER GaAs LED; Manuf_Part_1: 19-213-R6C-AP1Q2B-3T; Manuf_1: EVERLIGHT; Published: 8-Jun-2000; Revision: July-2002: Re-released for DXP Platform.; Publisher: Altium Limited
LD6 = LED2: Typical RED, GREEN, YELLOW, AMBER GaAs LED; Manuf_1: EVERLIGHT; Manuf_Part_1: 19-217/BHC-ZL1M2RY/3T; Published: 8-Jun-2000; Revision: July-2002: Re-released for DXP Platform.; Publisher: Altium Limited
R35 = res1: Resistor; Manuf_Part_1: RC0603FR-07330RL; Manuf_1: YAGEO; Published: 8-Jun-2000; Revision: July-2002: Re-released for DXP Platform.; Publisher: Altium Limited; Value: 330
R36 R41 R42 = Res1: Resistor; Manuf_Part_1: RC0603FR-07680RL; Manuf_1: YAGEO; Published: 8-Jun-2000; Revision: July-2002: Re-released for DXP Platform.; Publisher: Altium Limited; Value: 680
R37 = res1: Resistor; Manuf_Part_1: RC0402FR-071K5L; Manuf_1: YAGEO; Fitted: NO; Published: 8-Jun-2000; Revision: July-2002: Re-released for DXP Platform.; Publisher: Altium Limited; Value: 1K5
R38 = res1: as R3 on sheet ST_LINK_V2; Published: 8-Jun-2000; Revision: July-2002: Re-released for DXP Platform.; Publisher: Altium Limited; Value: 100
R39 = res1: Resistor; Manuf_Part_1: RC0603FR-07220KL; Manuf_1: YAGEO; Published: 8-Jun-2000; Revision: July-2002: Re-released for DXP Platform.; Publisher: Altium Limited; Value: 220K
R40 = Res1: Resistor; Manuf_Part_1: RC0603FR-07510RL; Manuf_1: YAGEO; Published: 8-Jun-2000; Revision: July-2002: Re-released for DXP Platform.; Publisher: Altium Limited; Value: 510
SB1 SB20 = Circuit Breaker: Solder: YES; Published: 24-Mar-1999; Revision: July-2002: Re-released for DXP Platform.; Publisher: Altium Limited
U5 = LIS3DSH_: MEMS motion sensor 3-axis - ±2g/±4g/±6g/±8g/±16g digital output accelerometer; Manuf_1: STM; Provided: ST; ref St: to be created; Manuf_Part_1: LIS3DSHTR; Distrib: STM; Footprint: LGA16(3*3); Order: LIS3DSHTR

## Sheet STM32Fx.SchDoc: MCU
size A4; DocumentNumber: 7; Revision: D.1(PCB.SCH); SheetNumber: 7; SheetTotal: 7
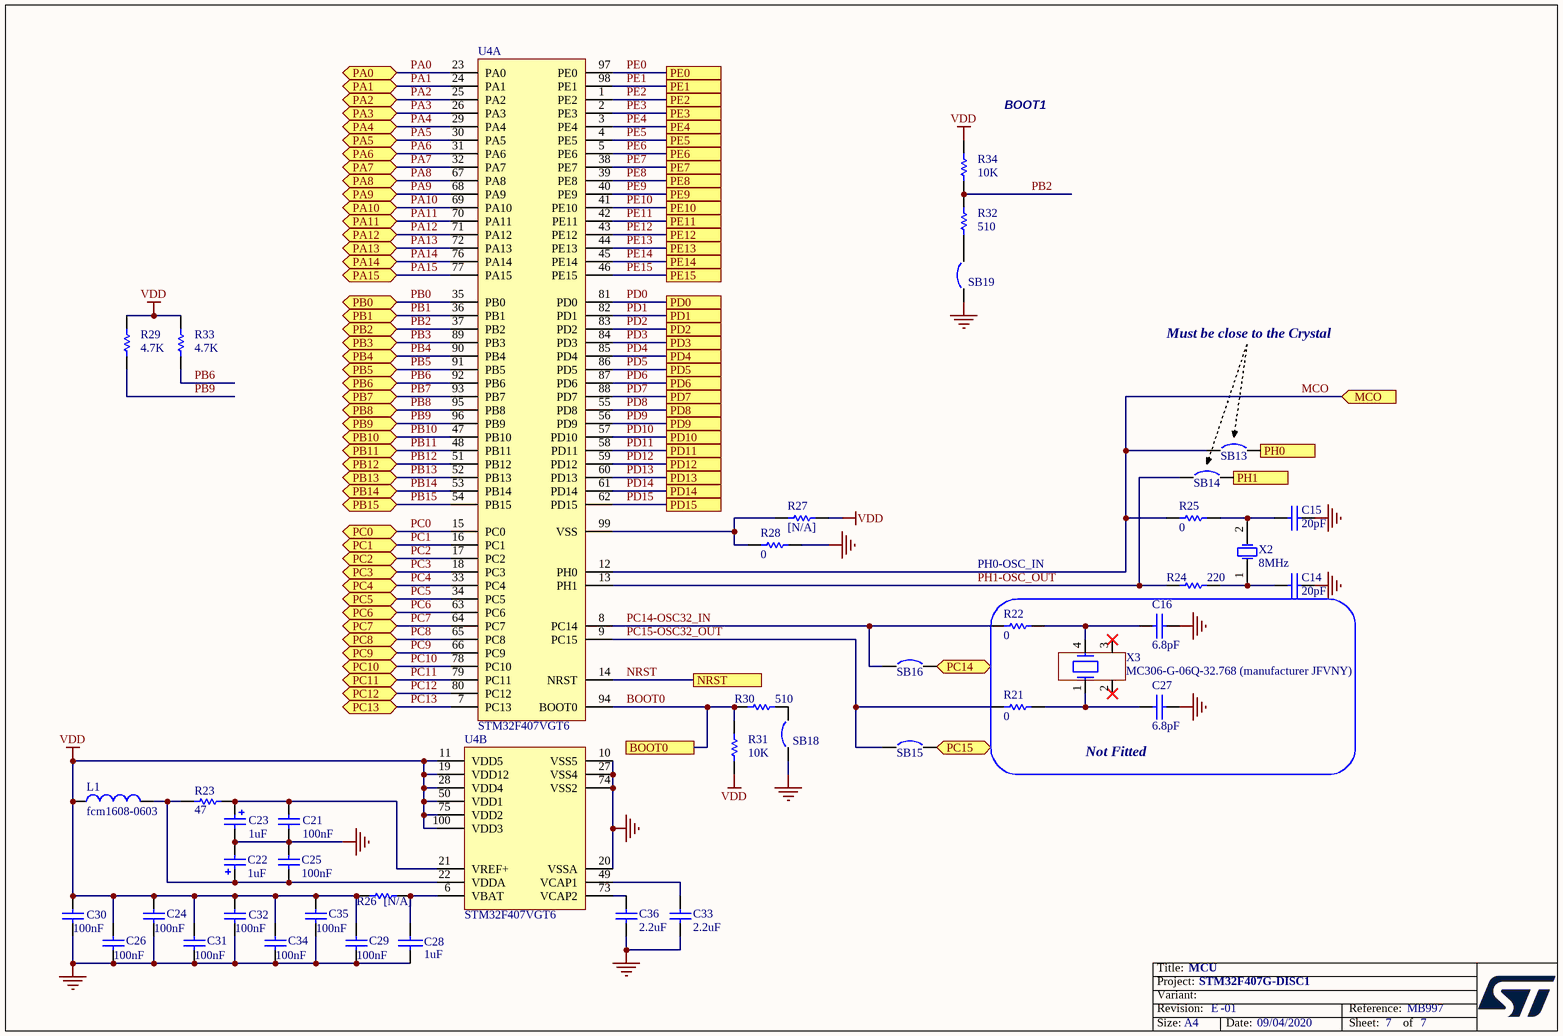
[diagram p5: STM32Fx.SchDoc]

### Parts
C14  20pF  [0603C]
C15  20pF  [0603C]
C16  6.8pF  [0603C]
C21  100nF  [0402C]
C22  1uF  [CASE-A]
C23  1uF  [CASE-A]
C24  100nF  [0402C]
C25  100nF  [0402C]
C26  100nF  [0402C]
C27  6.8pF  [0603C]
C28  1uF  [0603C]
C29  100nF  [0402C]
C30  100nF  [0402C]
C31  100nF  [0402C]
C32  100nF  [0402C]
C33  2.2uF  [CASE-A]
C34  100nF  [0402C]
C35  100nF  [0402C]
C36  2.2uF  [CASE-A]
L1  fcm1608-0603  [0603L]
R21  0  [0603R]
R22  0  [0603R]
R23  47  [0603R]
R24  220  [0603R]
R25  0  [0603R]
R26  [N/A]  [0603R]
R27  [N/A]  [0603R]
R28  0  [0603R]
R29  4.7K  [0402R]
R30  510  [0603R]
R31  10K  [0402R]
R32  510  [0603R]
R33  4.7K  [0402R]
R34  10K  [0402R]
SB13  Circuit Breaker  [JUMPER]  (value not drawn)
SB14  Circuit Breaker  [JUMPER]  (value not drawn)
SB15  Circuit Breaker  [JUMPER]  (value not drawn)
SB16  Circuit Breaker  [JUMPER]  (value not drawn)
SB18  Circuit Breaker  [JUMPER]  (value not drawn)
SB19  Circuit Breaker  [JUMPER]  (value not drawn)
U4  STM32F407VGT6  [QFP100-1414]  (parts A,B of 2)
X2  8MHz  [HC-49A]
X3  MC306-G-06Q-32.768 (manufacturer JFVNY)  [MC306-CRYSTAL]

### Blocks framed on the sheet
Not Fitted: C16 C27 R21 R22 X3

### Ports
BOOT0, MCO (in), NRST, PA0 (bidir), PA1 (bidir), PA2 (bidir), PA3 (bidir), PA4 (bidir), PA5 (bidir), PA6 (bidir), PA7 (bidir), PA8 (bidir), PA9 (bidir), PA10 (bidir), PA11 (bidir), PA12 (bidir), PA13 (bidir), PA14 (bidir), PA15 (bidir), PB0 (bidir), PB1 (bidir), PB2 (bidir), PB3 (bidir), PB4 (bidir), PB5 (bidir), PB6 (bidir), PB7 (bidir), PB8 (bidir), PB9 (bidir), PB10 (bidir), PB11 (bidir), PB12 (bidir), PB13 (bidir), PB14 (bidir), PB15 (bidir), PC0 (bidir), PC1 (bidir), PC2 (bidir), PC3 (bidir), PC4 (bidir), PC5 (bidir), PC6 (bidir), PC7 (bidir), PC8 (bidir), PC9 (bidir), PC10 (bidir), PC11 (bidir), PC12 (bidir), PC13 (bidir), PC14 (bidir), PC15 (bidir), PD0, PD1, PD2, PD3, PD4, PD5, PD6, PD7, PD8, PD9, PD10, PD11, PD12, PD13, PD14, PD15, PE0, PE1, PE2, PE3, PE4, PE5, PE6, PE7, PE8, PE9, PE10, PE11, PE12, PE13, PE14, PE15, PH0, PH1

### Nets
GND: C14.1 C15.1 C16.2 C21.1 C22.2 C23.2 C24.2 C25.1 C26.1 C27.2 C28.2 C29.1 C30.1 C31.1 C32.1 C33.2 C34.1 C35.2 C36.2 R28.2 SB18.1 SB19.1 U4.10(VSS5) U4.20(VSSA) U4.27(VSS4) U4.74(VSS2)
VDD: C24.1 C26.2 C29.2 C30.2 C31.2 C32.2 C34.2 C35.1 L1.1 R26.1 R27.2 R29.1 R31.2 R33.1 R34.1 U4.11(VDD5) U4.19(VDD12) U4.28(VDD4) U4.50(VDD1) U4.75(VDD2) U4.100(VDD3)
BOOT0: R30.2 R31.1 U4.94(BOOT0) ; port BOOT0
MCO: R25.1 SB13.1 U4.12(PH0) ; port MCO
NRST: U4.14(NRST) ; port NRST
PA0: U4.23(PA0) ; port PA0
PA1: U4.24(PA1) ; port PA1
PA2: U4.25(PA2) ; port PA2
PA3: U4.26(PA3) ; port PA3
PA4: U4.29(PA4) ; port PA4
PA5: U4.30(PA5) ; port PA5
PA6: U4.31(PA6) ; port PA6
PA7: U4.32(PA7) ; port PA7
PA8: U4.67(PA8) ; port PA8
PA9: U4.68(PA9) ; port PA9
PA10: U4.69(PA10) ; port PA10
PA11: U4.70(PA11) ; port PA11
PA12: U4.71(PA12) ; port PA12
PA13: U4.72(PA13) ; port PA13
PA14: U4.76(PA14) ; port PA14
PA15: U4.77(PA15) ; port PA15
PB0: U4.35(PB0) ; port PB0
PB1: U4.36(PB1) ; port PB1
PB2: R32.1 R34.2 U4.37(PB2) ; port PB2
PB3: U4.89(PB3) ; port PB3
PB4: U4.90(PB4) ; port PB4
PB5: U4.91(PB5) ; port PB5
PB6: R33.2 U4.92(PB6) ; port PB6
PB7: U4.93(PB7) ; port PB7
PB8: U4.95(PB8) ; port PB8
PB9: R29.2 U4.96(PB9) ; port PB9
PB10: U4.47(PB10) ; port PB10
PB11: U4.48(PB11) ; port PB11
PB12: U4.51(PB12) ; port PB12
PB13: U4.52(PB13) ; port PB13
PB14: U4.53(PB14) ; port PB14
PB15: U4.54(PB15) ; port PB15
PC0: U4.15(PC0) ; port PC0
PC1: U4.16(PC1) ; port PC1
PC2: U4.17(PC2) ; port PC2
PC3: U4.18(PC3) ; port PC3
PC4: U4.33(PC4) ; port PC4
PC5: U4.34(PC5) ; port PC5
PC6: U4.63(PC6) ; port PC6
PC7: U4.64(PC7) ; port PC7
PC8: U4.65(PC8) ; port PC8
PC9: U4.66(PC9) ; port PC9
PC10: U4.78(PC10) ; port PC10
PC11: U4.79(PC11) ; port PC11
PC12: U4.80(PC12) ; port PC12
PC13: U4.7(PC13) ; port PC13
PC14: SB16.2 ; port PC14
PC14-OSC32_IN: R22.1 SB16.1 U4.8(PC14)
PC15: SB15.2 ; port PC15
PC15-OSC32_OUT: R21.1 SB15.1 U4.9(PC15)
PD0: U4.81(PD0) ; port PD0
PD1: U4.82(PD1) ; port PD1
PD2: U4.83(PD2) ; port PD2
PD3: U4.84(PD3) ; port PD3
PD4: U4.85(PD4) ; port PD4
PD5: U4.86(PD5) ; port PD5
PD6: U4.87(PD6) ; port PD6
PD7: U4.88(PD7) ; port PD7
PD8: U4.55(PD8) ; port PD8
PD9: U4.56(PD9) ; port PD9
PD10: U4.57(PD10) ; port PD10
PD11: U4.58(PD11) ; port PD11
PD12: U4.59(PD12) ; port PD12
PD13: U4.60(PD13) ; port PD13
PD14: U4.61(PD14) ; port PD14
PD15: U4.62(PD15) ; port PD15
PE0: U4.97(PE0) ; port PE0
PE1: U4.98(PE1) ; port PE1
PE2: U4.1(PE2) ; port PE2
PE3: U4.2(PE3) ; port PE3
PE4: U4.3(PE4) ; port PE4
PE5: U4.4(PE5) ; port PE5
PE6: U4.5(PE6) ; port PE6
PE7: U4.38(PE7) ; port PE7
PE8: U4.39(PE8) ; port PE8
PE9: U4.40(PE9) ; port PE9
PE10: U4.41(PE10) ; port PE10
PE11: U4.42(PE11) ; port PE11
PE12: U4.43(PE12) ; port PE12
PE13: U4.44(PE13) ; port PE13
PE14: U4.45(PE14) ; port PE14
PE15: U4.46(PE15) ; port PE15
PH0: SB13.2 ; port PH0
PH1: SB14.2 ; port PH1
PH1-OSC_OUT: R24.2 SB14.1 U4.13(PH1)
NetC14_2: C14.2 R24.1 X2.1(OSC1)
NetC15_2: C15.2 R25.2 X2.2(OSC2)
NetC16_1: C16.1 R22.2 X3.4
NetC21_2: C21.2 C23.1 R23.1 U4.21(VREF+)
NetC22_1: C22.1 C25.2 L1.2 R23.2 U4.22(VDDA)
NetC27_1: C27.1 R21.2 X3.1
NetC28_1: C28.1 R26.2 U4.6(VBAT)
NetC33_1: C33.1 U4.49(VCAP1)
NetC36_1: C36.1 U4.73(VCAP2)
NetR27_1: R27.1 R28.1 U4.99(VSS)
NetR30_1: R30.1 SB18.2
NetR32_2: R32.2 SB19.2

Not connected (* = marked no-connect by the designer): X3 2* 3*

### Notes on the sheet
- BOOT1
- Must be close to the Crystal
- PH0-OSC_IN
- Title:
- Project:
- Size:
- Revision:
- Variant:
- A4
- -
- Date:
- Reference:
- Sheet:
- of

### Library data of the parts
C14 C15 = CAP: Capacitor; Manuf_Part_1: CC0603JRNPO9BN200; Manuf_1: YAGEO; Value: 20pF
C16 C27 = CAP: Capacitor; Fitted: NO; Value: 6.8pF
C21 C24-C26 C29-C32 C35 = Cap: as C2 on sheet ST_LINK_V2; Published: 8-Jun-2000; Revision: July-2002: Re-released for DXP Platform.; Publisher: Altium Limited; Value: 100nF
C22 C23 = Cap Pol1: as C59 on sheet Audio; Published: 8-Jun-2000; Revision: July-2002: Re-released for DXP Platform.; Publisher: Altium Limited; Value: 1uF
C28 = CAP: as C44 on sheet Audio; Value: 1uF
C33 C36 = Cap Low ESR: Low ESR Ceramic Capacitor (X7R); Manuf_1: YAGEO; Order: CC1206KKX7R7BB225; Published: 8-Jun-2000; Revision: July-2002: Re-released for DXP Platform.; Publisher: Altium Limited; Value: 2.2uF; Distrib: www.yageo.com; Manuf_Part_1: CC1206KKX7R7BB225
C34 = Cap: Capacitor; Manuf_1: YAGEO; Manuf_Part_1: CC0402KRX7R7BB104; Published: 8-Jun-2000; Revision: July-2002: Re-released for DXP Platform.; Publisher: Altium Limited; Value: 100nF
L1 = Inductor: Manuf_Part_1: FCM1608KF-601T03; Manuf_1: Tai-tech; Value: 100uH; Published: 8-Jun-2000; Revision: July-2002: Re-released for DXP Platform.; Publisher: Altium Limited
R21 R22 = Res1: Resistor; Fitted: NO; Published: 8-Jun-2000; Revision: July-2002: Re-released for DXP Platform.; Publisher: Altium Limited; Value: 0
R23 = Res1: Resistor; Manuf_Part_1: RC0603FR-0747RL; Manuf_1: YAGEO; Published: 8-Jun-2000; Revision: July-2002: Re-released for DXP Platform.; Publisher: Altium Limited; Value: 47
R24 = Res1: Resistor; Manuf_Part_1: RC0603FR-07220RL; Manuf_1: YAGEO; Published: 8-Jun-2000; Revision: July-2002: Re-released for DXP Platform.; Publisher: Altium Limited; Value: 220
R25 = Res1: Resistor; Manuf_1: YAGEO; Manuf_Part_1: RC0603JR-070RL; Fitted: NO; Published: 8-Jun-2000; Revision: July-2002: Re-released for DXP Platform.; Publisher: Altium Limited; Value: 0
R26 = res1: Resistor; Manuf_Part_1: RC0603JR-070RL; Manuf_1: YAGEO; Value: 0; Fitted: NO; Published: 8-Jun-2000; Revision: July-2002: Re-released for DXP Platform.; Publisher: Altium Limited
R27 = Res1: Resistor; Value: 0; Fitted: NO; Published: 8-Jun-2000; Revision: July-2002: Re-released for DXP Platform.; Publisher: Altium Limited
R28 = Res1: Resistor; Manuf_Part_1: RC0603JR-070RL; Manuf_1: YAGEO; Published: 8-Jun-2000; Revision: July-2002: Re-released for DXP Platform.; Publisher: Altium Limited; Value: 0
R29 R33 = res1: as R19 on sheet ST_LINK_V2; Published: 8-Jun-2000; Revision: July-2002: Re-released for DXP Platform.; Publisher: Altium Limited; Value: 4.7K
R30 = Res1: as R40 on sheet IO Peripherals; Published: 8-Jun-2000; Revision: July-2002: Re-released for DXP Platform.; Publisher: Altium Limited; Value: 510
R31 = res1: as R5 on sheet ST_LINK_V2; Published: 8-Jun-2000; Revision: July-2002: Re-released for DXP Platform.; Publisher: Altium Limited; Value: 10K
R32 = res1: Resistor; Manuf_Part_1: RC0603FR-07510RL; Manuf_1: YAGEO; Published: 8-Jun-2000; Revision: July-2002: Re-released for DXP Platform.; Publisher: Altium Limited; Value: 510
R34 = res1: as R6 on sheet ST_LINK_V2; Published: 8-Jun-2000; Revision: July-2002: Re-released for DXP Platform.; Publisher: Altium Limited; Value: 10K
SB13 SB14 SB19 = Circuit Breaker: Solder: NO; Published: 24-Mar-1999; Revision: July-2002: Re-released for DXP Platform.; Publisher: Altium Limited
SB15 SB16 SB18 = Circuit Breaker: Solder: YES; Published: 24-Mar-1999; Revision: July-2002: Re-released for DXP Platform.; Publisher: Altium Limited
U4 = STM32F407VGT6: STM32 Manta (STM32F407VGT6); Manuf_1: STM; Provided: ST; Ref St: 9175122; ECCN_US/EU: 3A991A2/NEC; Manuf_Part_1: STM32F407VGT6; Distrib: ST; Footprint: QFP100
X2 = XTAL: as X1 on sheet ST_LINK_V2; Published: 8-Jun-2000; LatestRevisionDate: 17-Jul-2002; LatestRevisionNote: Re-released for DXP Platform.; PackageReference: R38; Publisher: Altium Limited
X3 = MC306: Fitted: NO

## Sheet USB_OTG_FS.SchDoc: USB_OTG_FS
size A4; DocumentNumber: 6; Revision: D.1(PCB.SCH); SheetNumber: 6; SheetTotal: 7
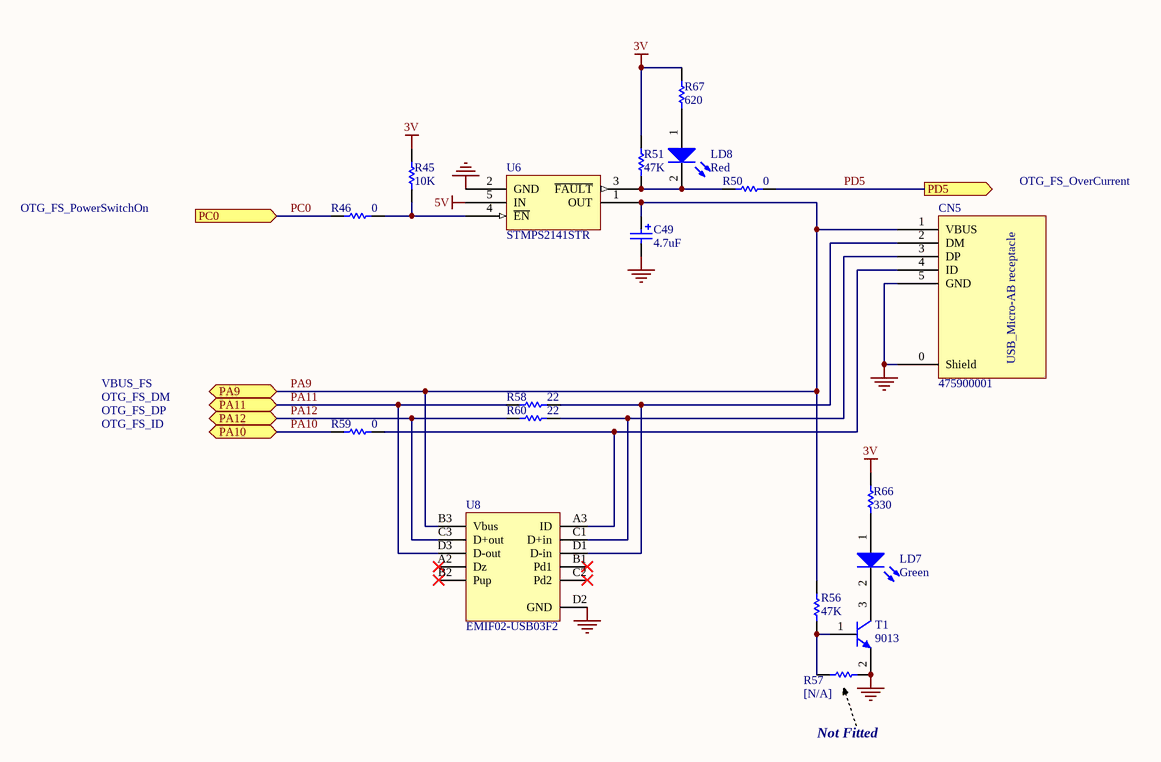
[diagram p6: USB_OTG_FS.SchDoc]

### Parts
C49  4.7uF  [CASE-A]
CN5  475900001  [USB-MICRO-AB_new]
LD7  Green  [LED0603]
LD8  Red  [LED0603]
R45  10K  [0402R]
R46  0  [0603R]
R50  0  [0603R]
R51  47K  [0402R]
R56  47K  [0402R]
R57  [N/A]  [0603R]
R58  22  [0402R]
R59  0  [0603R]
R60  22  [0402R]
R66  330  [0603R]
R67  620  [0603R]
T1  9013  [SOT23]
U6  STMPS2141STR  [SOT-23-5L]
U8  EMIF02-USB03F2  [FLIPCHIP(11)]

### Ports
PA9 (bidir), PA10 (bidir), PA11 (bidir), PA12 (bidir), PC0 (in), PD5 (out)

### Nets
3V: R45.1 R51.1 R66.2 R67.2
5V: U6.5(IN)
GND: C49.2 CN5.0(Shield) CN5.5(GND) R57.1 T1.2(E) U6.2(GND) U8.D2(GND)
PA9: C49.1 CN5.1(VBUS) R56.2 U6.1(OUT) U8.B3(Vbus) ; port PA9
PA10: R59.2 ; port PA10
PA11: R58.2 U8.D3(D-out) ; port PA11
PA12: R60.2 U8.C3(D+out) ; port PA12
PC0: R46.2 ; port PC0
PD5: R50.1 ; port PD5
NetCN5_2: CN5.2(DM) R58.1 U8.D1(D-in)
NetCN5_3: CN5.3(DP) R60.1 U8.C1(D+in)
NetCN5_4: CN5.4(ID) R59.1 U8.A3(ID)
NetLD7_1: LD7.1(A) R66.1
NetLD7_2: LD7.2(K) T1.3(C)
NetLD8_1: LD8.1(A) R67.1
NetLD8_2: LD8.2(K) R50.2 R51.2 U6.3(~{FAULT})
NetR45_2: R45.2 R46.1 U6.4(~{EN})
NetR56_1: R56.1 R57.2 T1.1(B)

Not connected (* = marked no-connect by the designer): U8 A2(Dz)* B1(Pd1)* B2(Pup)* C2(Pd2)*

### Notes on the sheet
- OTG_FS_PowerSwitchOn
- OTG_FS_OverCurrent
- VBUS_FS
- OTG_FS_ID
- OTG_FS_DM
- OTG_FS_DP
- Not Fitted
- Title:
- Project:
- Size:
- Revision:
- Variant:
- A4
- -
- Date:
- Reference:
- Sheet:
- of
- (in symbol 475900001_) USB_Micro-AB receptacle
- (in symbol 475900001) USB_Micro-AB receptacle

### Library data of the parts
C49 = Cap Pol1: Polarized Capacitor (Radial); Manuf_Part_1: TAJA475K016R; Manuf_1: AVX; Published: 8-Jun-2000; Revision: July-2002: Re-released for DXP Platform.; Publisher: Altium Limited; Value: 4.7uF
CN5 = 475900001_: Manuf_Part_1: 47590-0001; Manuf_1: Molex; Value: 47590-0001
LD7 = LED2: Typical RED, GREEN, YELLOW, AMBER GaAs LED; Manuf_Part_1: 19-213SYGC/S530-E2/TR8; Manuf_1: EVERLIGHT; Published: 8-Jun-2000; Revision: July-2002: Re-released for DXP Platform.; Publisher: Altium Limited
LD8 = LED2: Typical RED, GREEN, YELLOW, AMBER GaAs LED; Manuf_1: EVERLIGHT; Manuf_Part_1: 19-213-R6C-AP1Q2B-3T; Published: 8-Jun-2000; Revision: July-2002: Re-released for DXP Platform.; Publisher: Altium Limited
R45 = res1: as R6 on sheet ST_LINK_V2; Published: 8-Jun-2000; Revision: July-2002: Re-released for DXP Platform.; Publisher: Altium Limited; Value: 10K
R46 R50 R59 = Res1: as R28 on sheet STM32Fx; Published: 8-Jun-2000; Revision: July-2002: Re-released for DXP Platform.; Publisher: Altium Limited; Value: 0
R51 R56 = res1: Resistor; Manuf_Part_1: RC0402FR-0747KL; Manuf_1: YAGEO; Published: 8-Jun-2000; Revision: July-2002: Re-released for DXP Platform.; Publisher: Altium Limited; Value: 47K
R57 = res1: Resistor; Value: 1K; Fitted: NO; Published: 8-Jun-2000; Revision: July-2002: Re-released for DXP Platform.; Publisher: Altium Limited
R58 R60 = Res1: Resistor; Manuf_Part_1: RC0402FR-0722RL; Manuf_1: YAGEO; Published: 8-Jun-2000; Revision: July-2002: Re-released for DXP Platform.; Publisher: Altium Limited; Value: 22
R66 = res1: as R35 on sheet IO Peripherals; Published: 8-Jun-2000; Revision: July-2002: Re-released for DXP Platform.; Publisher: Altium Limited; Value: 330
R67 = Res1: Resistor; Manuf_Part_1: RC0603FR-07620RL; Manuf_1: YAGEO; Published: 8-Jun-2000; Revision: July-2002: Re-released for DXP Platform.; Publisher: Altium Limited; Value: 620
T1 = NPN_NEW: NPN Bipolar Transistor; Manuf_Part_1: MMBT9013; Manuf_1: unisonic; Code - JEDEC: TO-226-AA; Value: MMBT9013; Published: 8-Jun-2000; Revision: July-2002: Re-released for DXP Platform.; Publisher: Altium Limited
U6 = STMPS2141STR: Enhanced single channel power switches; Manuf_1: STM; Provided: ST; Order: STMPS2141STR; Manuf_Part_1: STMPS2141STR
U8 = EMIF02-USB03F2: 2-line IPAD, EMI filter including ESD protection; Manuf_1: STM; Provided: ST; Order: EMIF02-USB03F2; Manuf_Part_1: EMIF02-USB03F2

## Nets that join several sheets
2V5: ST_LINK_V2 (C17.1 C18.2 U3.5), Audio (7 pins)
3V: Top (P2.5 P2.6), ST_LINK_V2 (18 pins), Audio (10 pins), IO Peripherals (C39.2 U5.1 U5.14 U5.15), USB_OTG_FS (R45.1 R51.1 R66.2 R67.2)
5V: Top (P2.3 P2.4), ST_LINK_V2 (9 pins), USB_OTG_FS (U6.5)
GND: Top (10 pins), ST_LINK_V2 (41 pins), Audio (28 pins), IO Peripherals (14 pins), STM32Fx (26 pins), USB_OTG_FS (7 pins)
VDD: Top (P1.3 P1.4 P2.22), ST_LINK_V2 (JP1.2 SB17.2), IO Peripherals (B1.3 B1.4 R37.2 R38.2), STM32Fx (21 pins)
MCO: ST_LINK_V2 (C61.1 R68.2), STM32Fx (R25.1 SB13.1 U4.12)
NRST: ST_LINK_V2 (SB11.2), IO Peripherals (SB1.1), STM32Fx (U4.14)
PA0: IO Peripherals (SB20.1), STM32Fx (U4.23)
PA4: Audio (R48.2 U7.40), STM32Fx (U4.29)
PA5: IO Peripherals (U5.4), STM32Fx (U4.30)
PA6: IO Peripherals (U5.7), STM32Fx (U4.31)
PA7: IO Peripherals (U5.6), STM32Fx (U4.32)
PA9: STM32Fx (U4.68), USB_OTG_FS (5 pins)
PA10: STM32Fx (U4.69), USB_OTG_FS (R59.2)
PA11: STM32Fx (U4.70), USB_OTG_FS (R58.2 U8.D3)
PA12: STM32Fx (U4.71), USB_OTG_FS (R60.2 U8.C3)
PA13: ST_LINK_V2 (SB9.1), STM32Fx (U4.72)
PA14: ST_LINK_V2 (SB5.1), STM32Fx (U4.76)
PB3: ST_LINK_V2 (SB12.2), STM32Fx (U4.89)
PB6: Audio (U7.2), STM32Fx (R33.2 U4.92)
PB9: Audio (U7.1), STM32Fx (R29.2 U4.96)
PB10: Audio (U9.3), STM32Fx (U4.47)
PC0: STM32Fx (U4.15), USB_OTG_FS (R46.2)
PC3: Audio (R55.1 U9.4), STM32Fx (U4.18)
PC4: Audio (R49.1), STM32Fx (U4.33)
PC7: Audio (U7.37), STM32Fx (U4.64)
PC10: Audio (U7.38), STM32Fx (U4.78)
PC12: Audio (U7.39), STM32Fx (U4.80)
PD4: Audio (R43.1 U7.32), STM32Fx (U4.85)
PD5: STM32Fx (U4.86), USB_OTG_FS (R50.1)
PD12: IO Peripherals (R40.2), STM32Fx (U4.59)
PD13: IO Peripherals (R36.2), STM32Fx (U4.60)
PD14: IO Peripherals (R41.2), STM32Fx (U4.61)
PD15: IO Peripherals (R42.2), STM32Fx (U4.62)
PE0: IO Peripherals (U5.11), STM32Fx (U4.97)
PE1: IO Peripherals (U5.9), STM32Fx (U4.98)
PE3: IO Peripherals (U5.8), STM32Fx (U4.2)

## Assembly variants
F407VGT6: not fitted C16 C27 C38 C61 R2 R21 R22 R27 R49 R57 R64 SB2 SB4 SB6 SB8 SB10 SB13 SB14 SB17 SB19 X3